# Altium schematic sheet Pi_Boot_Control.SchDoc
size A; SheetNumber: 1; SheetTotal: 10
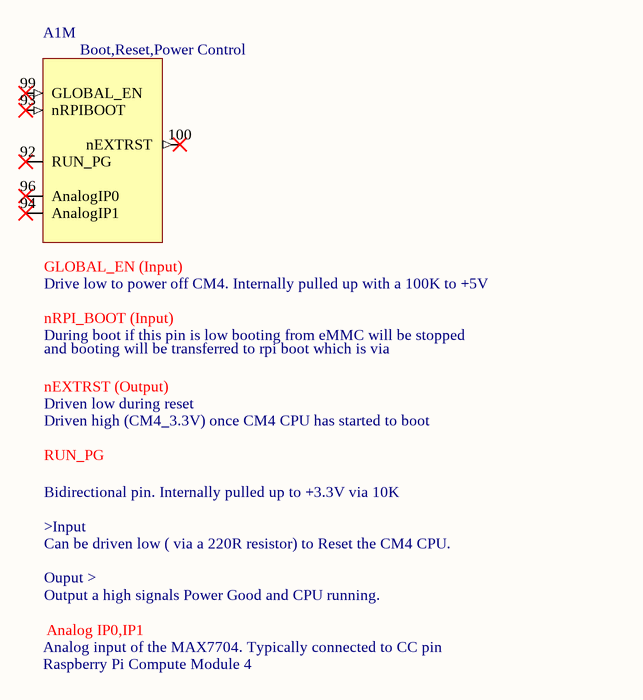
[diagram p0: Pi_Boot_Control.SchDoc]

## Parts
A1  Raspberry Pi Compute Module 4  [CM4-F40C-100DS-0.4v_1.5mm_0mm]  (part M of 21)  (no BOM)

## Nets

Not connected (* = marked no-connect by the designer): A1 92(RUN_PG)* 93(nRPIBOOT)* 94(AnalogIP1)* 96(AnalogIP0)* 99(GLOBAL_EN)* 100(nEXTRST)*

## Notes on the sheet
- (in symbol CM4, part M) Boot,Reset,Power Control; GLOBAL_EN (Input); Drive low to power off CM4. Internally pulled up with a 100K to +5V; nRPI_BOOT (Input); During boot if this pin is low booting from eMMC will be stopped; and booting will be transferred to rpi boot which is via; nEXTRST (Output); Driven low during reset; Driven high (CM4_3.3V) once CM4 CPU has started to boot; Bidirectional pin. Internally pulled up to +3.3V via 10K / >Input / Can be driven low ( via a 220R resistor) to Reset the CM4 CPU. / Ouput > / Output a high signals Power Good and CPU running.; Analog IP0,IP1; Analog input of the MAX7704. Typically connected to CC pin

## Library data of the parts
A1 = CM4: Raspberry Pi Compute Module 4 by Amornthep Phunsin; MPN: -